# Altium project LED_Project.PrjPcb
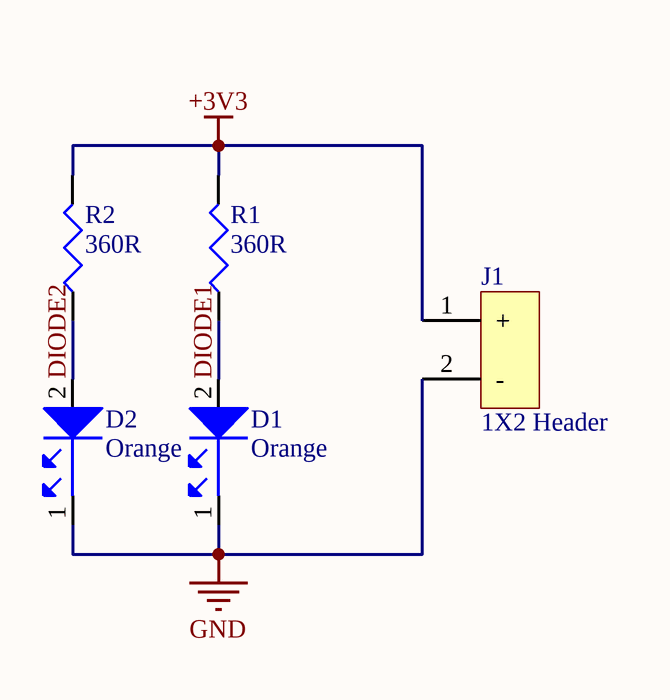
[diagram p0: Sch1.SchDoc]
1 sheet, 5 parts. Net scope: global (net labels, ports and power ports of the same name join across sheets).
Board file: PCB1.PcbDoc

## Sheet Sch1.SchDoc
size A; SheetNumber: 1; SheetTotal: 1

### Parts
D1  Orange  [LED0603 O]
D2  Orange  [LED0603 O]
J1  1X2 Header  [Header 1x2]
R1  360R  [R0805]
R2  360R  [R0805]

### Nets
+3V3: J1.1(+) R1.2 R2.2
GND: D1.1 D2.1 J1.2(-)
DIODE1: D1.2 R1.1
DIODE2: D2.2 R2.1

### Library data of the parts
D1 D2 = LNJ8W0C83RA: Orange 620nm LED Indication - Discrete 1.95V 0603 (1608 Metric); Manufacturer: Panasonic SSG; Luminous Intensity: 17.5mcd; Viewing Angle: 165°; Lens Style: Round; Test Current: 5mA; Number of LEDs: 1; Supplier 1: Digi-Key; Manufacturer Part Number: LNJ8W0C83RA; RoHS: Yes; Category: LEDs Optoelectronics; Stock 1: 87; Pricing 1: 1=0.13000, 10=0.11200 (USD); Mount: Surface Mount; Case/Package: 0603; Number of Pins: 2; Color: Orange; Case Code (Metric): 1608; Case Code (Imperial): 0603; Package Quantity: 5000; Packaging: Tape and Reel; Forward Voltage: 1.95V; Wavelength: 620nm; Dominant Wavelength: 620nm; Forward Current: 5mA; Length: 1.6mm; Width: 0.8mm; Height: 0.55mm; RoHS Compliant: Yes; ComponentLink1URL: https://datasheet.ciiva.com/5685/1385197-5685549.pdf?src-supplier=Farnell; ComponentLink1Description: https://datasheet.ciiva.com/5685/1385197-5685549.pdf?src-supplier=Farnell; ComponentLink2URL: https://datasheet.ciiva.com/11775/0900766b80f0a8cc-11775425.pdf?src-supplier=Rs; ComponentLink2Description: https://datasheet.ciiva.com/11775/0900766b80f0a8cc-11775425.pdf?src-supplier=Rs; Supplier Part Number 1: P14141CT-ND
J1 = 22-27-2021: CONN HEADER 2POS .100 VERT TIN; Manufacturer: Molex; Contact Resistance: 20mR; Current Rating: 4A; Voltage Rating (AC): 250V; Number of Positions: 2; Insulation Resistance: 50GR; Gender: Male; Voltage Rating: 500V; Pitch: 2.54mm; Approvals: UL,CSA; Supplier 1: Digi-Key; Manufacturer Part Number: 22-27-2021; RoHS: Yes; Category: Headers and Wire Housings; Stock 1: 156265; Pricing 1: 1=0.30000, 10=0.24500, 100=0.18000, 1000=0.14317, 5000=0.12272, 10000=0.11453 (USD); Mount: Through Hole; Contact Plating: Tin; Contact Material: Tin; Color: White; Housing Color: Natural; Material: Nylon; Housing Material: Nylon; Weight: 0.00769oz; Min Operating Temperature: 0°C; Max Operating Temperature: 75°C; Number of Rows: 1; Number of Contacts: 2; Number of Circuits: 2; Orientation: Straight; Voltage Rating (DC): 250V; Package Quantity: 24000; Max Current Rating: 4A; Contact Gender: Male; Packaging: Bulk; Termination: Through Hole; Working Voltage: 250V; Series: 6410; Contact Type: -; Length: 10.16mm; Height: 11.7mm; Lead Pitch: 2.54mm; Depth: 5.8mm; Radiation Hardening: No; Lead Free: Lead Free; Flammability Rating: UL94 V-0; RoHS Compliant: Yes; Supplier Part Number 1: WM4111-ND
R1 R2 = CRCW0805360RFKEA: RES SMD 360 OHM 1% 1/8W 0805; Manufacturer: Vishay; Number of Terminals/Pins: 2; Temperature Coefficient: 100ppm/°C; Max Power Dissipation: 125mW; Voltage Rating (DC): 150V; Supplier 1: Digi-Key; Manufacturer Part Number: CRCW0805360RFKEA; RoHS: Yes; Category: Chip SMD Resistors; Stock 1: 2500; Pricing 1: 1=0.10000, 10=0.06700, 100=0.02710, 1000=0.01219, 2500=0.01058 (USD); Case/Package: 0805; Number of Pins: 2; Case Code (Metric): 2012; Case Code (Imperial): 0805; Contact Plating: Tin; Weight: 0.000194oz; Min Operating Temperature: -55°C; Max Operating Temperature: 155°C; Resistance: 360R; Tolerance: 1%; Packaging: Cut Tape; Resistor Type: Thick Film; Package Quantity: 5000; Number of Terminations: 2; Features: Automotive AEC-Q200; Power Rating: 125mW; Voltage Rating: 150V; Termination: SMD/SMT; Series: CRCW; Technology: THICK FILM; Length: 2mm; Width: 1.25mm; Height: 0.45mm; Depth: 1.25mm; Ratings: AEC-Q200; Radiation Hardening: No; Lead Free: Lead Free; Military Standard: Not; RoHS Compliant: Yes; ComponentLink1URL: https://datasheet.ciiva.com/2467/dcrcwe3-2467773.pdf?src-supplier=Digi-Key; ComponentLink1Description: https://datasheet.ciiva.com/2467/dcrcwe3-2467773.pdf?src-supplier=Digi-Key; Supplier Part Number 1: 541-360CDKR-ND

## Assembly variants
LED 2 not fitted: not fitted D2 R2